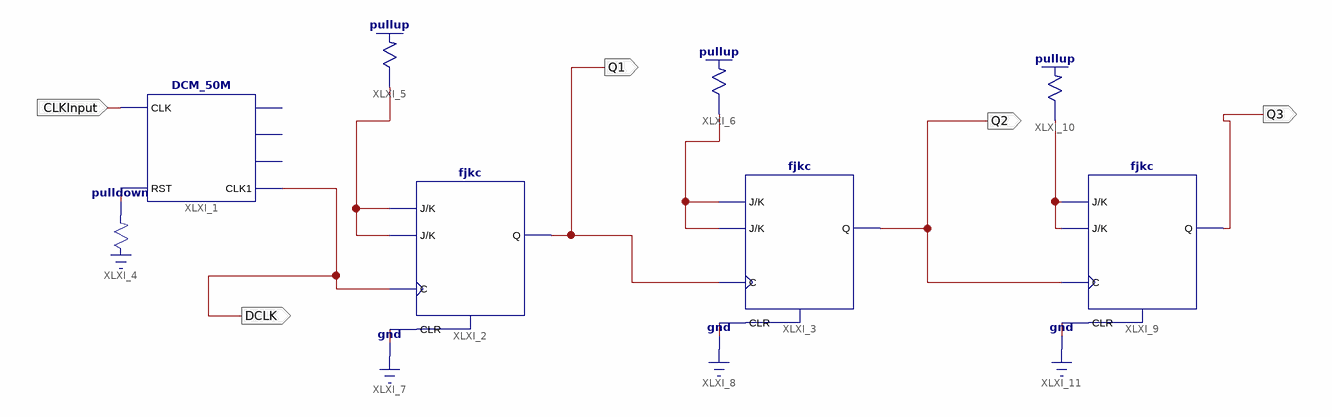
[diagram p0: schematic sheet 1]
// Xilinx ISE schematic lab8_experiment2.sch (spartan3e) as structural Verilog: 8 symbols, 5 ports
module lab8_experiment2 (
  input  CLKInput,
  output DCLK,
  output Q1,
  output Q2,
  output Q3
);

  wire XLXN_2, XLXN_3, XLXN_4, XLXN_12;

  DCM_50M XLXI_1 (.CLK(CLKInput), .RST(XLXN_2), .CLK1(DCLK));  // open: CLK1M, CLK10k, CLK1k
  fjkc XLXI_2 (.C(DCLK), .CLR(1'b0), .J(XLXN_3), .K(XLXN_3), .Q(Q1));
  fjkc XLXI_3 (.C(Q1), .CLR(1'b0), .J(XLXN_4), .K(XLXN_4), .Q(Q2));
  \pulldown  XLXI_4 (.O(XLXN_2));
  \pullup  XLXI_5 (.O(XLXN_3));
  \pullup  XLXI_6 (.O(XLXN_4));
  fjkc XLXI_9 (.C(Q2), .CLR(1'b0), .J(XLXN_12), .K(XLXN_12), .Q(Q3));
  \pullup  XLXI_10 (.O(XLXN_12));
endmodule
